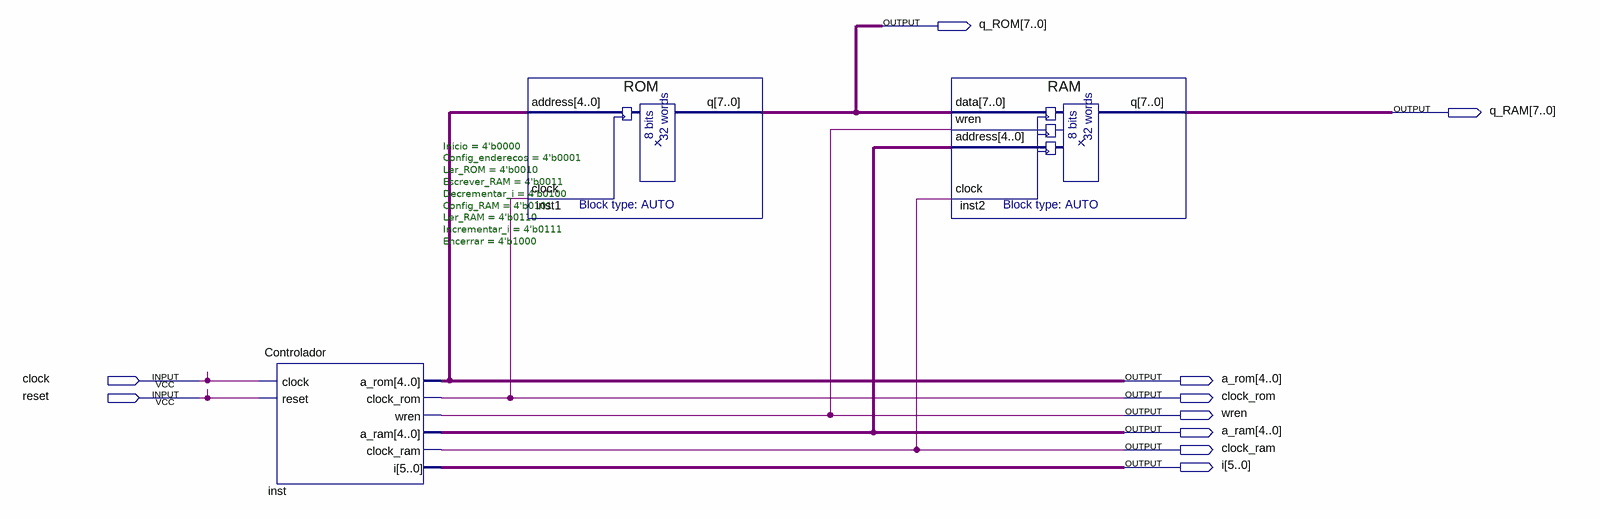
[diagram p0: schematic sheet]
// Quartus schematic TesteMemoria.bdf as structural Verilog: 3 symbols, 10 pins
module TesteMemoria (
  input  clock,
  input  reset,
  output [7:0] q_ROM,
  output [7:0] q_RAM,
  output [4:0] a_rom,
  output clock_rom,
  output wren,
  output [4:0] a_ram,
  output clock_ram,
  output [5:0] i
);

  Controlador #(.Inicio(4'b0000), .Config_enderecos(4'b0001), .Ler_ROM(4'b0010), .Escrever_RAM(4'b0011), .Decrementar_i(4'b0100), .Config_RAM(4'b0101), .Ler_RAM(4'b0110), .Incrementar_i(4'b0111), .Encerrar(4'b1000)) inst (
    .clock(clock), .reset(reset), .a_rom(a_rom), .clock_rom(clock_rom), .wren(wren), .a_ram(a_ram),
    .clock_ram(clock_ram), .i(i));
  ROM inst1 (.address(a_rom), .clock(clock_rom), .q(q_ROM));
  RAM inst2 (.data(q_ROM), .wren(wren), .address(a_ram), .clock(clock_ram), .q(q_RAM));
endmodule
